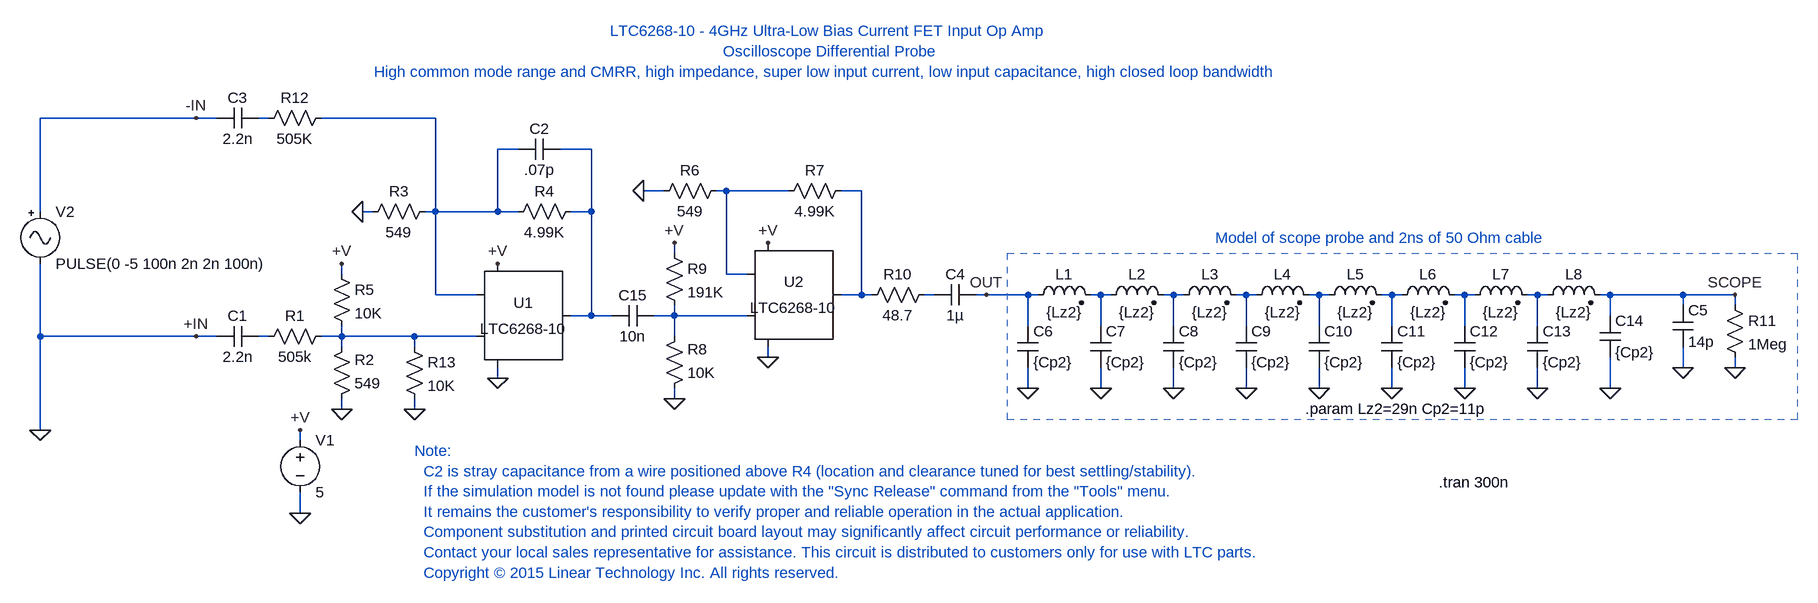
[diagram p0: schematic LTC6268_isoSPI_DiffAmp-1-msecScale.asc]
LTC6268_isoSPI_DiffAmp-1-msecScale.asc, the LTspice schematic file:
Version 4
SHEET 1 2196 700
WIRE -288 -160 -528 -160
WIRE -256 -160 -288 -160
WIRE -176 -160 -192 -160
WIRE 80 -160 -96 -160
WIRE 208 -112 176 -112
WIRE 320 -112 272 -112
WIRE 432 -48 400 -48
WIRE 528 -48 512 -48
WIRE 624 -48 528 -48
WIRE 736 -48 704 -48
WIRE -528 -16 -528 -160
WIRE -16 -16 -32 -16
WIRE 80 -16 80 -160
WIRE 80 -16 64 -16
WIRE 176 -16 176 -112
WIRE 176 -16 80 -16
WIRE 208 -16 176 -16
WIRE 320 -16 320 -112
WIRE 320 -16 288 -16
WIRE 448 48 448 32
WIRE -64 80 -64 64
WIRE 528 80 528 -48
WIRE 560 80 528 80
WIRE 80 112 80 -16
WIRE 144 112 80 112
WIRE 736 112 736 -48
WIRE 736 112 704 112
WIRE 752 112 736 112
WIRE 848 112 832 112
WIRE 928 112 912 112
WIRE 992 112 928 112
WIRE 1008 112 992 112
WIRE 1104 112 1088 112
WIRE 1120 112 1104 112
WIRE 1216 112 1200 112
WIRE 1232 112 1216 112
WIRE 1328 112 1312 112
WIRE 1344 112 1328 112
WIRE 1440 112 1424 112
WIRE 1456 112 1440 112
WIRE 1552 112 1536 112
WIRE 1568 112 1552 112
WIRE 1664 112 1648 112
WIRE 1680 112 1664 112
WIRE 1776 112 1760 112
WIRE 1792 112 1776 112
WIRE 1888 112 1872 112
WIRE 2000 112 1888 112
WIRE 2080 112 2000 112
WIRE 2000 128 2000 112
WIRE 2080 128 2080 112
WIRE 320 144 320 -16
WIRE 320 144 288 144
WIRE 352 144 320 144
WIRE 448 144 448 128
WIRE 448 144 416 144
WIRE 560 144 448 144
WIRE 1888 144 1888 112
WIRE 992 160 992 112
WIRE 1104 160 1104 112
WIRE 1216 160 1216 112
WIRE 1328 160 1328 112
WIRE 1440 160 1440 112
WIRE 1552 160 1552 112
WIRE 1664 160 1664 112
WIRE 1776 160 1776 112
WIRE -528 176 -528 64
WIRE -288 176 -528 176
WIRE -256 176 -288 176
WIRE -176 176 -192 176
WIRE -64 176 -64 160
WIRE -64 176 -96 176
WIRE 48 176 -64 176
WIRE 144 176 48 176
WIRE 448 176 448 144
WIRE -64 192 -64 176
WIRE 48 192 48 176
WIRE 592 208 592 192
WIRE 2000 224 2000 192
WIRE 2080 224 2080 208
WIRE 176 240 176 224
WIRE 992 256 992 224
WIRE 1104 256 1104 224
WIRE 1216 256 1216 224
WIRE 1328 256 1328 224
WIRE 1440 256 1440 224
WIRE 1552 256 1552 224
WIRE 1664 256 1664 224
WIRE 1776 256 1776 224
WIRE 1888 256 1888 208
WIRE 448 272 448 256
WIRE -64 288 -64 272
WIRE 48 288 48 272
WIRE -528 320 -528 176
WIRE -128 336 -128 320
WIRE -128 448 -128 416
FLAG -64 288 0
FLAG -32 -16 0
FLAG 176 240 0
FLAG 176 64 +V
FLAG -128 320 +V
FLAG -128 448 0
FLAG -288 -160 -IN
FLAG -288 176 +IN
FLAG 448 272 0
FLAG 592 32 +V
FLAG 592 208 0
FLAG 928 112 OUT
FLAG 2080 224 0
FLAG 2080 112 SCOPE
FLAG 400 -48 0
FLAG -528 320 0
FLAG -64 64 +V
FLAG 48 288 0
FLAG 448 32 +V
FLAG 992 256 0
FLAG 1104 256 0
FLAG 1216 256 0
FLAG 1328 256 0
FLAG 1440 256 0
FLAG 1552 256 0
FLAG 1664 256 0
FLAG 1776 256 0
FLAG 1888 256 0
FLAG 2000 224 0
SYMBOL LTC6268-10 176 144 R0
SYMATTR InstName U1
SYMBOL res -80 160 R90
WINDOW 0 0 56 VBottom 2
WINDOW 3 32 56 VTop 2
SYMATTR InstName R1
SYMATTR Value 505k
SYMBOL res -80 288 M180
WINDOW 0 36 76 Left 2
WINDOW 3 36 40 Left 2
SYMATTR InstName R2
SYMATTR Value 549
SYMBOL res 80 -32 R90
WINDOW 0 0 56 VBottom 2
WINDOW 3 32 56 VTop 2
SYMATTR InstName R3
SYMATTR Value 549
SYMBOL res 304 -32 R90
WINDOW 0 0 56 VBottom 2
WINDOW 3 32 56 VTop 2
SYMATTR InstName R4
SYMATTR Value 4.99K
SYMBOL cap -192 160 R90
WINDOW 0 0 32 VBottom 2
WINDOW 3 32 32 VTop 2
SYMATTR InstName C1
SYMATTR Value 2.2n
SYMBOL res -80 64 R0
SYMATTR InstName R5
SYMATTR Value 10K
SYMBOL voltage -128 320 R0
WINDOW 123 0 0 Left 2
WINDOW 39 0 0 Left 2
SYMATTR InstName V1
SYMATTR Value 5
SYMBOL signal -528 -32 R0
WINDOW 123 0 0 Left 2
WINDOW 39 0 0 Left 2
SYMATTR InstName V2
SYMATTR Value PULSE(0 -5 100n 2n 2n 100n)
SYMBOL cap 272 -128 R90
WINDOW 0 0 32 VBottom 2
WINDOW 3 32 32 VTop 2
SYMATTR InstName C2
SYMATTR Value .07p
SYMBOL cap -192 -176 R90
WINDOW 0 0 32 VBottom 2
WINDOW 3 32 32 VTop 2
SYMATTR InstName C3
SYMATTR Value 2.2n
SYMBOL LTC6268-10 592 112 R0
SYMATTR InstName U2
SYMBOL res 528 -64 R90
WINDOW 0 0 56 VBottom 2
WINDOW 3 32 56 VTop 2
SYMATTR InstName R6
SYMATTR Value 549
SYMBOL res 720 -64 R90
WINDOW 0 0 56 VBottom 2
WINDOW 3 32 56 VTop 2
SYMATTR InstName R7
SYMATTR Value 4.99K
SYMBOL res 432 272 M180
WINDOW 0 36 76 Left 2
WINDOW 3 36 40 Left 2
SYMATTR InstName R8
SYMATTR Value 10K
SYMBOL res 432 32 R0
SYMATTR InstName R9
SYMATTR Value 191K
SYMBOL cap 912 96 R90
WINDOW 0 0 32 VBottom 2
WINDOW 3 32 32 VTop 2
SYMATTR InstName C4
SYMATTR Value 1µ
SYMBOL res 848 96 R90
WINDOW 0 0 56 VBottom 2
WINDOW 3 32 56 VTop 2
SYMATTR InstName R10
SYMATTR Value 48.7
SYMBOL res 2064 112 R0
SYMATTR InstName R11
SYMATTR Value 1Meg
SYMBOL cap 1984 128 R0
SYMATTR InstName C5
SYMATTR Value 14p
SYMBOL ind2 992 128 R270
WINDOW 0 32 56 VTop 2
WINDOW 3 5 56 VBottom 2
SYMATTR InstName L1
SYMATTR Value {Lz2}
SYMATTR Type ind
SYMBOL ind2 1104 128 R270
WINDOW 0 32 56 VTop 2
WINDOW 3 5 56 VBottom 2
SYMATTR InstName L2
SYMATTR Value {Lz2}
SYMATTR Type ind
SYMBOL ind2 1216 128 R270
WINDOW 0 32 56 VTop 2
WINDOW 3 5 56 VBottom 2
SYMATTR InstName L3
SYMATTR Value {Lz2}
SYMATTR Type ind
SYMBOL ind2 1328 128 R270
WINDOW 0 32 56 VTop 2
WINDOW 3 5 56 VBottom 2
SYMATTR InstName L4
SYMATTR Value {Lz2}
SYMATTR Type ind
SYMBOL ind2 1440 128 R270
WINDOW 0 32 56 VTop 2
WINDOW 3 5 56 VBottom 2
SYMATTR InstName L5
SYMATTR Value {Lz2}
SYMATTR Type ind
SYMBOL ind2 1552 128 R270
WINDOW 0 32 56 VTop 2
WINDOW 3 5 56 VBottom 2
SYMATTR InstName L6
SYMATTR Value {Lz2}
SYMATTR Type ind
SYMBOL ind2 1664 128 R270
WINDOW 0 32 56 VTop 2
WINDOW 3 5 56 VBottom 2
SYMATTR InstName L7
SYMATTR Value {Lz2}
SYMATTR Type ind
SYMBOL ind2 1776 128 R270
WINDOW 0 32 56 VTop 2
WINDOW 3 5 56 VBottom 2
SYMATTR InstName L8
SYMATTR Value {Lz2}
SYMATTR Type ind
SYMBOL cap 976 160 R0
SYMATTR InstName C6
SYMATTR Value {Cp2}
SYMBOL cap 1088 160 R0
SYMATTR InstName C7
SYMATTR Value {Cp2}
SYMBOL cap 1200 160 R0
SYMATTR InstName C8
SYMATTR Value {Cp2}
SYMBOL cap 1312 160 R0
SYMATTR InstName C9
SYMATTR Value {Cp2}
SYMBOL cap 1424 160 R0
SYMATTR InstName C10
SYMATTR Value {Cp2}
SYMBOL cap 1536 160 R0
SYMATTR InstName C11
SYMATTR Value {Cp2}
SYMBOL cap 1648 160 R0
SYMATTR InstName C12
SYMATTR Value {Cp2}
SYMBOL cap 1760 160 R0
SYMATTR InstName C13
SYMATTR Value {Cp2}
SYMBOL cap 1872 144 R0
SYMATTR InstName C14
SYMATTR Value {Cp2}
SYMBOL res -192 -144 R270
WINDOW 0 32 56 VTop 2
WINDOW 3 0 56 VBottom 2
SYMATTR InstName R12
SYMATTR Value 505K
SYMBOL cap 416 128 R90
WINDOW 0 0 32 VBottom 2
WINDOW 3 32 32 VTop 2
SYMATTR InstName C15
SYMATTR Value 10n
SYMBOL res 32 176 R0
SYMATTR InstName R13
SYMATTR Value 10K
TEXT 1560 272 Top 2 !.param Lz2=29n Cp2=11p
TEXT 48 352 Left 2 ;Note:\n  C2 is stray capacitance from a wire positioned above R4 (location and clearance tuned for best settling/stability).\n  If the simulation model is not found please update with the "Sync Release" command from the "Tools" menu.\n  It remains the customer's responsibility to verify proper and reliable operation in the actual application.\n  Component substitution and printed circuit board layout may significantly affect circuit performance or reliability.\n  Contact your local sales representative for assistance. This circuit is distributed to customers only for use with LTC parts.\n  Copyright © 2015 Linear Technology Inc. All rights reserved.
TEXT 688 -216 Bottom 2 ;LTC6268-10 - 4GHz Ultra-Low Bias Current FET Input Op Amp\nOscilloscope Differential Probe\nHigh common mode range and CMRR, high impedance, super low input current, low input capacitance, high closed loop bandwidth
TEXT 1536 40 Bottom 2 ;Model of scope probe and 2ns of 50 Ohm cable
TEXT 1624 400 Left 2 !.tran 300n
RECTANGLE Normal 2176 304 960 48 2

The netlist it stands for:
* LTC6268_isoSPI_DiffAmp-1-msecScale.asc
XU1 N016 N002 N003 +V 0 NC_01 LTC6268-10
R1 N016 N015 505k
R2 0 N016 549
R3 N002 0 549
R4 N003 N002 4.99K
C1 N015 0 2.2n
R5 +V N016 10K
V1 +V 0 5
V2 -IN 0 PULSE(0 -5 100n 2n 2n 100n)
C2 N003 N002 .07p
C3 N001 -IN 2.2n
XU2 N014 N004 N005 +V 0 NC_02 LTC6268-10
R6 N004 0 549
R7 N005 N004 4.99K
R8 0 N014 10K
R9 +V N014 191K
C4 OUT N006 1µ
R10 N006 N005 48.7
R11 SCOPE 0 1Meg
C5 SCOPE 0 14p
L1 OUT N007 {Lz2}
L2 N007 N008 {Lz2}
L3 N008 N009 {Lz2}
L4 N009 N010 {Lz2}
L5 N010 N011 {Lz2}
L6 N011 N012 {Lz2}
L7 N012 N013 {Lz2}
L8 N013 SCOPE {Lz2}
C6 OUT 0 {Cp2}
C7 N007 0 {Cp2}
C8 N008 0 {Cp2}
C9 N009 0 {Cp2}
C10 N010 0 {Cp2}
C11 N011 0 {Cp2}
C12 N012 0 {Cp2}
C13 N013 0 {Cp2}
C14 SCOPE 0 {Cp2}
R12 N001 N002 505K
C15 N014 N003 10n
R13 N016 0 10K
.param Lz2=29n Cp2=11p
* Note:
*   C2 is stray capacitance from a wire positioned above R4 (location and clearance tuned for best settling/stability).
*   If the simulation model is not found please update with the "Sync Release" command from the "Tools" menu.
*   It remains the customer's responsibility to verify proper and reliable operation in the actual application.
*   Component substitution and printed circuit board layout may significantly affect circuit performance or reliability.
*   Contact your local sales representative for assistance. This circuit is distributed to customers only for use with LTC parts.
*   Copyright © 2015 Linear Technology Inc. All rights reserved.
* LTC6268-10 - 4GHz Ultra-Low Bias Current FET Input Op Amp
* Oscilloscope Differential Probe
* High common mode range and CMRR, high impedance, super low input current, low input capacitance, high closed loop bandwidth
* Model of scope probe and 2ns of 50 Ohm cable
.tran 300n
.lib LTC2.lib
.backanno
.end